# Altium project lm3886 Audio Amplifier.PrjPcb
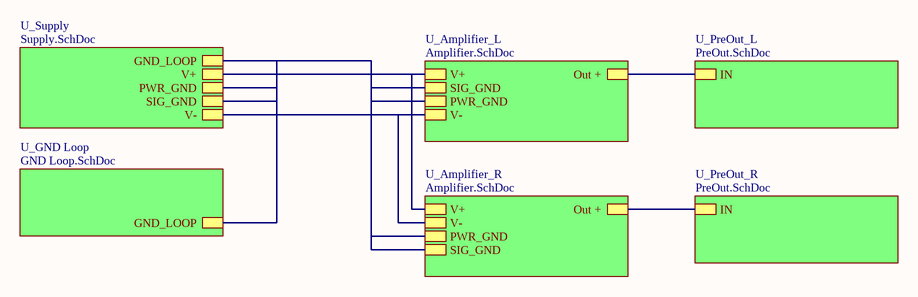
[diagram p0: lm3886 Audio Amplifier.SchDoc]
5 sheets, 125 parts. Net scope: hierarchical (ports join the sheet entries above them; power ports are global).
Board file: lm3886 Audio Amplifier.PcbDoc
Sheets:
  lm3886 Audio Amplifier.SchDoc
    U_Supply = Supply.SchDoc
    U_GND Loop = GND Loop.SchDoc
    U_Amplifier_L = Amplifier.SchDoc
    U_Amplifier_R = Amplifier.SchDoc
    U_PreOut_L = PreOut.SchDoc
    U_PreOut_R = PreOut.SchDoc

## Sheet lm3886 Audio Amplifier.SchDoc
size A4

### Sub-sheets
U_Amplifier_L = Amplifier.SchDoc: V+, V-, PWR_GND, SIG_GND, Out +
U_Amplifier_R = Amplifier.SchDoc: V+, V-, PWR_GND, SIG_GND, Out +
U_GND Loop = GND Loop.SchDoc: GND_LOOP
U_PreOut_L = PreOut.SchDoc: IN
U_PreOut_R = PreOut.SchDoc: IN
U_Supply = Supply.SchDoc: V+, V-, PWR_GND, SIG_GND, GND_LOOP

### Nets
GND: sheet U_Supply/PWR_GND, sheet U_Supply/SIG_GND, sheet U_Supply/GND_LOOP

## Sheet Supply.SchDoc
size A4
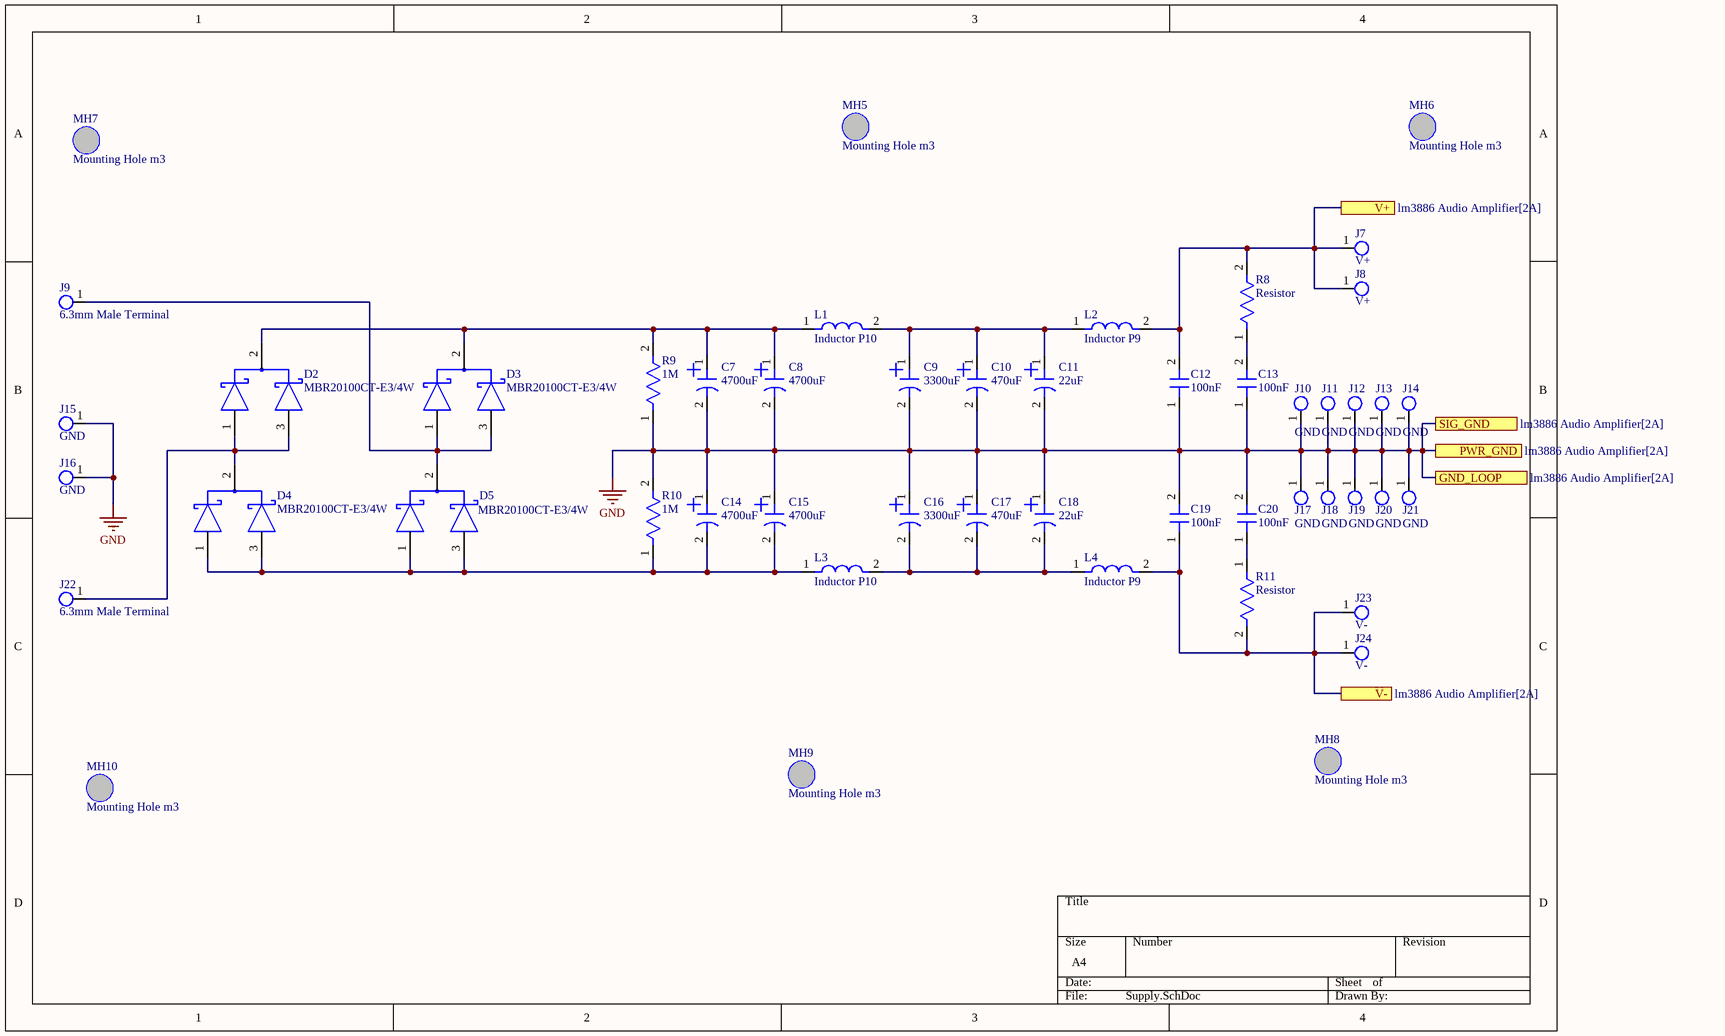
[diagram p1: Supply.SchDoc]

### Parts
C7  4700uF  [Capacitor electrolytic 25x41mm]
C8  4700uF  [Capacitor electrolytic 25x41mm]
C9  3300uF  [Capacitor electrolytic 16x21mm]
C10  470uF  [Capacitor electrolytic 10x16mm]
C11  22uF  [Capacitor electrolytic 5x11mm]
C12  100nF  [Capacitor P5 3x7.5mm]
C13  100nF  [Capacitor P5 5x7.5mm]
C14  4700uF  [Capacitor electrolytic 25x41mm]
C15  4700uF  [Capacitor electrolytic 25x41mm]
C16  3300uF  [Capacitor electrolytic 16x21mm]
C17  470uF  [Capacitor electrolytic 10x16mm]
C18  22uF  [Capacitor electrolytic 5x11mm]
C19  100nF  [Capacitor P5 3x7.5mm]
C20  100nF  [Capacitor P5 5x7.5mm]
D2  MBR20100CT-E3/4W  [FP-MBR20100CT-E3-4W-MFG]
D3  MBR20100CT-E3/4W  [FP-MBR20100CT-E3-4W-MFG]
D4  MBR20100CT-E3/4W  [FP-MBR20100CT-E3-4W-MFG]
D5  MBR20100CT-E3/4W  [FP-MBR20100CT-E3-4W-MFG]
J7  V+  [Terminal 6.3mm male]
J8  V+  [Terminal 6.3mm male]
J9  6.3mm Male Terminal  [Terminal 6.3mm male]
J10  GND  [Terminal 6.3mm male]
J11  GND  [Terminal 6.3mm male]
J12  GND  [Terminal 6.3mm male]
J13  GND  [Terminal 6.3mm male]
J14  GND  [Terminal 6.3mm male]
J15  GND  [Terminal 6.3mm male]
J16  GND  [Terminal 6.3mm male]
J17  GND  [Terminal 6.3mm male]
J18  GND  [Terminal 6.3mm male]
J19  GND  [Terminal 6.3mm male]
J20  GND  [Terminal 6.3mm male]
J21  GND  [Terminal 6.3mm male]
J22  6.3mm Male Terminal  [Terminal 6.3mm male]
J23  V-  [Terminal 6.3mm male]
J24  V-  [Terminal 6.3mm male]
L1  Inductor P10  [Inductor p10]
L2  Inductor P9  [Inductor p10]
L3  Inductor P10  [Inductor p10]
L4  Inductor P9  [Inductor p10]
MH5  Mounting Hole m3  [Mounting Hole]
MH6  Mounting Hole m3  [Mounting Hole]
MH7  Mounting Hole m3  [Mounting Hole]
MH8  Mounting Hole m3  [Mounting Hole]
MH9  Mounting Hole m3  [Mounting Hole]
MH10  Mounting Hole m3  [Mounting Hole]
R8  Resistor  [Resistor 0617 2W Vertical]
R9  1M  [Resistor 0207 1/4W]
R10  1M  [Resistor 0207 1/4W]
R11  Resistor  [Resistor 0617 2W Vertical]

### Ports
GND_LOOP (see lm3886 Audio Amplifier[2A]), PWR_GND (see lm3886 Audio Amplifier[2A]), SIG_GND (see lm3886 Audio Amplifier[2A]), V+ (see lm3886 Audio Amplifier[2A]), V- (see lm3886 Audio Amplifier[2A])

### Nets
GND: C7.2 C8.2 C9.2 C10.2 C11.2 C12.1 C13.1 C14.1 C15.1 C16.1 C17.1 C18.1 C19.2 C20.2 J10.1 J11.1 J12.1 J13.1 J14.1 J15.1 J16.1 J17.1 J18.1 J19.1 J20.1 J21.1 R9.1 R10.2 ; port PWR_GND, port SIG_GND, port GND_LOOP
NetC7_1: C7.1 C8.1 D2.2(COMMON_CATHODE) D3.2(COMMON_CATHODE) L1.1 R9.2
NetC9_1: C9.1 C10.1 C11.1 L1.2 L2.1
NetC12_2: C12.2 J7.1 J8.1 L2.2 R8.2 ; port V+
NetC13_2: C13.2 R8.1
NetC14_2: C14.2 C15.2 D4.1(1_ANODE) D4.3(2_ANODE) D5.1(1_ANODE) D5.3(2_ANODE) L3.1 R10.1
NetC16_2: C16.2 C17.2 C18.2 L3.2 L4.1
NetC19_1: C19.1 J23.1 J24.1 L4.2 R11.2 ; port V-
NetC20_1: C20.1 R11.1
NetD2_1: D2.1(1_ANODE) D2.3(2_ANODE) D4.2(COMMON_CATHODE) J22.1
NetD3_1: D3.1(1_ANODE) D3.3(2_ANODE) D5.2(COMMON_CATHODE) J9.1

### Library data of the parts
C7-C11 C14-C18 = Capacitor Polar
C12 C13 C19 C20 = Capacitor
D2-D5 = CMP-00030-42878425-1: MBR20100CT-E3/4W Dual Common-Cathode High-Voltage Schottky Rectifier; Forward Voltage: 800mV; Max Junction Temperature (Tj): 150°C; Forward Current: 20A; Max Reverse Voltage (DC): 100V; Max Surge Current: 150A; Max Reverse Leakage Current: 100µA; Average Rectified Current: 10A; Element Configuration: Common Cathode; Length: 10.5156mm; Schedule B: 8541100080, 8541100080; Case/Package: TO-220AB; NexarPartId: 42878425; Number of Pins: 3; Min Operating Temperature: -65°C; Reverse Voltage: 100V; Height: 15.3162mm; Peak Non-Repetitive Surge Current: 150A; RoHS: Compliant; Max Operating Temperature: 150°C; Radiation Hardening: No; Lead Free: Lead Free; Mount: Through Hole; Max Repetitive Reverse Voltage (Vrrm): 100V; Max Forward Surge Current (Ifsm): 150A; Width: 4.699mm; Peak Reverse Current: 100µA
J7 J8 J10-J21 J23 J24 = 6.3mm Male Terminal
L1-L4 = Inductor
R9 R10 = Resistor

## Sheet GND Loop.SchDoc
size A4
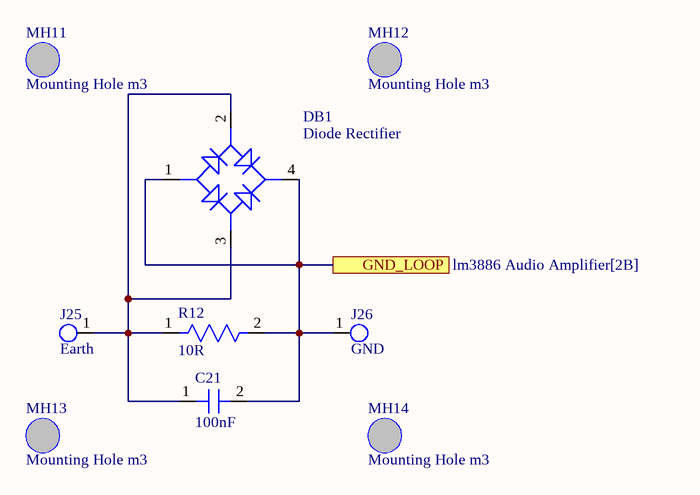
[diagram p2: GND Loop.SchDoc]

### Parts
C21  100nF  [Capacitor P15 7.2x18.3mm]
DB1  Diode Rectifier  [KBPC rectifier]
J25  Earth  [Terminal 6.3mm male]
J26  GND  [Terminal 6.3mm male]
MH11  Mounting Hole m3  [Mounting Hole]
MH12  Mounting Hole m3  [Mounting Hole]
MH13  Mounting Hole m3  [Mounting Hole]
MH14  Mounting Hole m3  [Mounting Hole]
R12  10R  [Resistor 0823 5W]

### Ports
GND_LOOP (see lm3886 Audio Amplifier[2B])

### Nets
NetC21_1: C21.1 DB1.2 DB1.3 J25.1 R12.1
NetC21_2: C21.2 DB1.1 DB1.4 J26.1 R12.2 ; port GND_LOOP

### Library data of the parts
C21 = Capacitor
J25 J26 = 6.3mm Male Terminal
R12 = Resistor

## Sheet Amplifier.SchDoc
size A4; SheetNumber: 1; SheetTotal: 1
Used 2 times, as channels U_Amplifier_L, U_Amplifier_R. Parts and nets are listed once, with the designators drawn on the sheet.
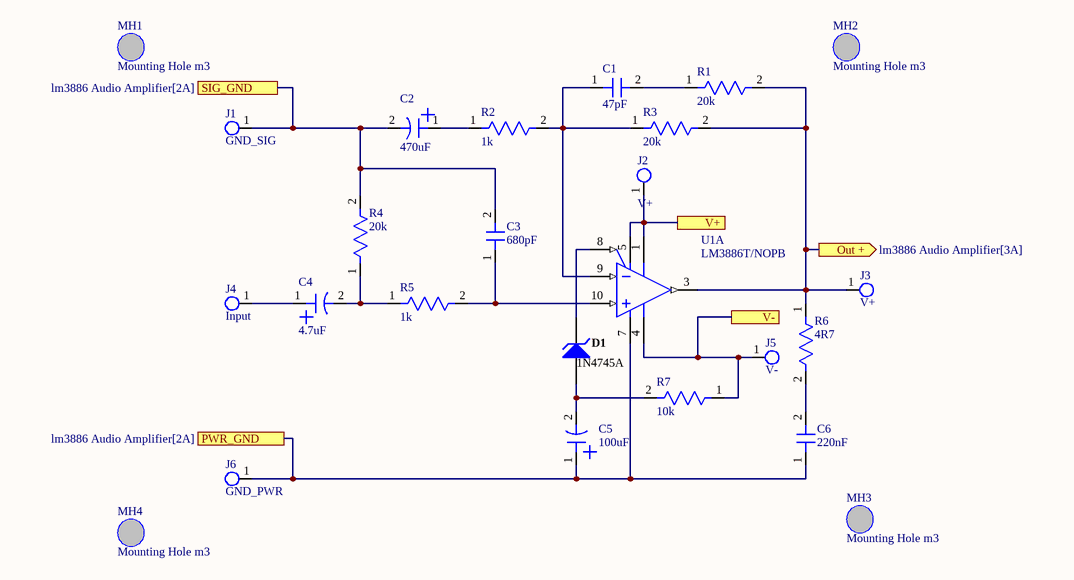
[diagram p3: Amplifier.SchDoc]

### Parts
C1  47pF  [Capacitor P5 2.4x4.4mm]
C2  470uF  [Capacitor electrolytic 10x16mm]
C3  680pF  [Capacitor P5 2.4x4.4mm]
C4  4.7uF  [Capacitor electrolytic 5x11mm]
C5  100uF  [Capacitor electrolytic 6x11mm]
C6  220nF  [Capacitor P5 5x7.5mm]
D1  1N4745A  [FAIR-DO-41-2_V]
J1  GND_SIG  [Terminal 6.3mm male]
J2  V+  [Terminal 6.3mm male]
J3  V+  [Terminal 6.3mm male]
J4  Input  [Terminal 6.3mm male]
J5  V-  [Terminal 6.3mm male]
J6  GND_PWR  [Terminal 6.3mm male]
MH1  Mounting Hole m3  [Mounting Hole]
MH2  Mounting Hole m3  [Mounting Hole]
MH3  Mounting Hole m3  [Mounting Hole]
MH4  Mounting Hole m3  [Mounting Hole]
R1  20k  [Resistor 0207 1/4W]
R2  1k  [Resistor 0207 1/4W]
R3  20k  [Resistor 0207 1/4W]
R4  20k  [Resistor 0207 1/4W]
R5  1k  [Resistor 0207 1/4W]
R6  4R7  [Resistor 0617 2W]
R7  10k  [Resistor 0207 1/4W]
U1  LM3886T/NOPB  [TI-NDJ11]  (part A of 2)

### Ports
Out + (out, see lm3886 Audio Amplifier[3A]), PWR_GND (see lm3886 Audio Amplifier[2A]), SIG_GND (see lm3886 Audio Amplifier[2A]), V+ (see lm3886 Audio Amplifier[2A]), V- (see lm3886 Audio Amplifier[2A])

### Nets
Out +: J3.1 R1.2 R3.2 R6.1 U1.3(OUTPUT) ; port Out +
PWR_GND: C5.1 C6.1 J6.1 U1.7(GND) ; port PWR_GND
SIG_GND: C2.2 C3.2 J1.1 R4.2 ; port SIG_GND
V+: J2.1 U1.1(V+) U1.5(V+) ; port V+
V-: J5.1 R7.1 U1.4(V-) ; port V-
NetC1_1: C1.1 R2.2 R3.1 U1.9(VIN-)
NetC1_2: C1.2 R1.1
NetC2_1: C2.1 R2.1
NetC3_1: C3.1 R5.2 U1.10(VIN+)
NetC4_1: C4.1 J4.1
NetC4_2: C4.2 R4.1 R5.1
NetC5_2: C5.2 D1.1(A) R7.2
NetC6_2: C6.2 R6.2
NetD1_2: D1.2(K) U1.8(MUTE)

### Channels
U_Amplifier_L: designators end in _U_Amplifier_L; ports Out +=NetJ3_U_Amplifier_L_1 PWR_GND=NetC5_U_Amplifier_L_1 SIG_GND=NetC2_U_Amplifier_L_2 V+=NetJ2_U_Amplifier_L_1 V-=NetJ5_U_Amplifier_L_1
U_Amplifier_R: designators end in _U_Amplifier_R; ports Out +=NetJ3_U_Amplifier_R_1 PWR_GND=NetC5_U_Amplifier_R_1 SIG_GND=NetC2_U_Amplifier_R_2 V+=NetJ2_U_Amplifier_R_1 V-=NetJ5_U_Amplifier_R_1

### Library data of the parts
C1 C3 C6 = Capacitor
C2 C4 C5 = Capacitor Polar
D1 = CMP-0892-00004-1: Zener Diode, 16V, 1W, 5%, -65 to 200 degC, 2-Pin DO-41, Body 2.72 x 5.2 mm, RoHS; Manufacturer: Fairchild Semiconductor; VZ (Max.) (V): 16.8; PD (W): 1; IR (uA): 5; Test Current IZ (mA): 15.5; VZ (Min.) (V): 15.2; ZZ (Max) (ohm): 14; ComponentLink2Description: Datasheet; DatasheetVersion: Rev. H3; Tolerance: 5%; Mounting Technology: Through Hole; PartNumber: 1N4745A; ComponentLink3URL: http://www.fairchildsemi.com/dwg/DO/DO41A.pdf; ComponentLink2URL: http://www.fairchildsemi.com/ds/1N/1N4744A.pdf; ComponentLink3Description: Package Specification; Operating and Storage Temperature Range: -65 to 200 degC; ComponentLink1Description: Manufacturer URL; PackageDescription: 2-Pin Axial leaded, Body 2.72 x 5.2 mm, Lead Spread 25.4 mm; RoHS: TRUE; ComponentLink1URL: http://www.fairchildsemi.com/; PackageReference: DO-41-2; PackageVersion: Rev. 2
J1-J6 = 6.3mm Male Terminal
R1-R7 = Resistor
U1 = CMP-0994-00122-1: High-Performance 68 W Audio Power Amplifier with Mute, 0 to 70 degC, 11-pin FM (NDJ11), Green (RoHS & no Sb/Br); Manufacturer: Texas Instruments; Input Type: Analog; SubFamily: Mid/High-Power Amplifier; PackageVersion: Rev. B, 05/2013; ComponentLink2Description: Datasheet; DatasheetVersion: SNAS091C; PackageReference: NDJ11; ComponentLink3Description: Package Specification; ComponentLink1URL: http://www.ti.com/; Mounting Technology: Through Hole; ComponentLink1Description: Manufacturer URL; PartNumber: LM3886T/NOPB; PackageDescription: 11-Pin Metal Flange Mount, Body 20.02 x 4.5, Pitch 1.7 mm; Eco-Plan: Green (RoHS & no Sb/Br); ComponentLink2URL: http://www.ti.com/general/docs/lit/getliterature.tsp?genericPartNumber=LM3886&fileType=pdf; ComponentLink3URL: http://www.ti.com/lit/ds/symlink/lm3886.pdf

## Sheet PreOut.SchDoc
size A4
Used 2 times, as channels U_PreOut_L, U_PreOut_R. Parts and nets are listed once, with the designators drawn on the sheet.
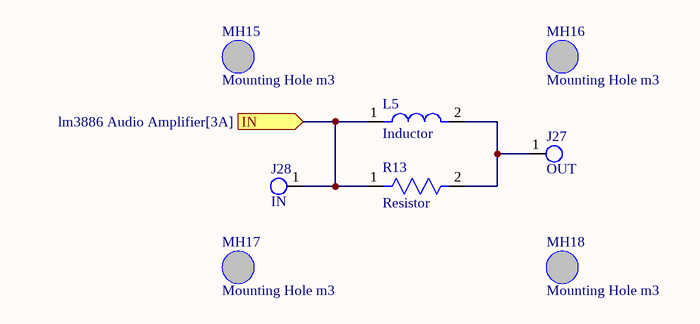
[diagram p4: PreOut.SchDoc]

### Parts
J27  OUT  [Terminal 6.3mm male]
J28  IN  [Terminal 6.3mm male]
L5  Inductor  [Inductor p26]
MH15  Mounting Hole m3  [Mounting Hole]
MH16  Mounting Hole m3  [Mounting Hole]
MH17  Mounting Hole m3  [Mounting Hole]
MH18  Mounting Hole m3  [Mounting Hole]
R13  Resistor  [Resistor 0823 5W]

### Ports
IN (in, see lm3886 Audio Amplifier[3A])

### Nets
IN: J28.1 L5.1 R13.1 ; port IN
NetJ27_1: J27.1 L5.2 R13.2

### Channels
U_PreOut_L: designators end in _U_PreOut_L; ports IN=NetJ28_U_PreOut_L_1
U_PreOut_R: designators end in _U_PreOut_R; ports IN=NetJ28_U_PreOut_R_1

### Library data of the parts
J27 J28 = 6.3mm Male Terminal